# Altium schematic sheet RAM.SchDoc: SDRAM
size B; Engineer: M. Jones; Organization: Michael Jones; DocumentNumber: 7; Revision: RA.1; SheetNumber: 7; SheetTotal: 7
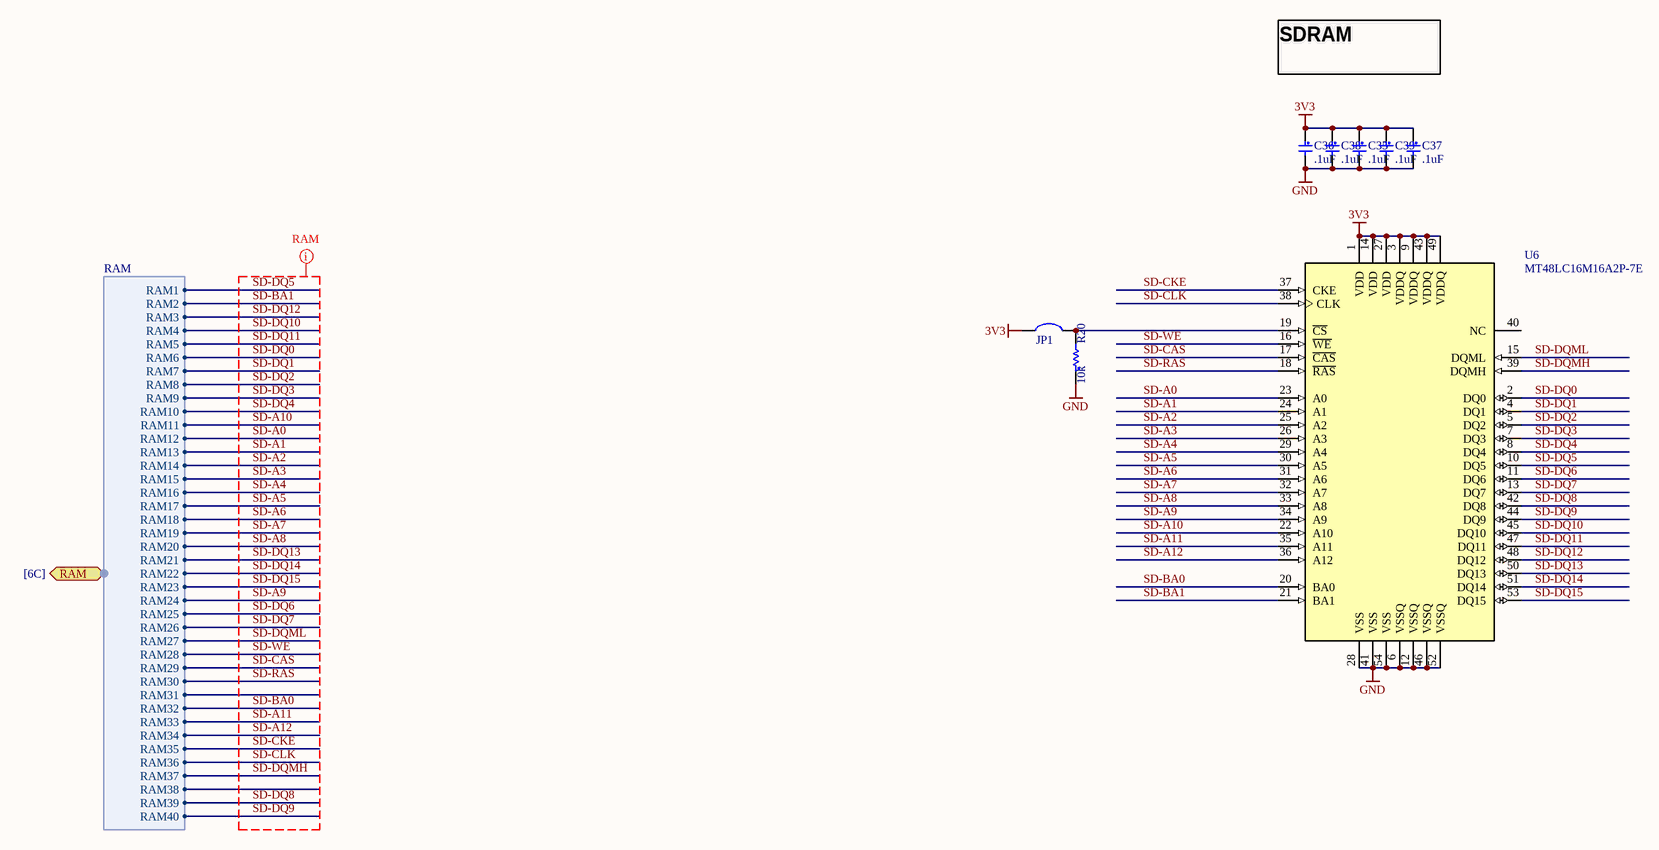
[diagram p0: RAM.SchDoc]

## Parts
C35  .1uF  [c0603]
C36  .1uF  [c0603]
C37  .1uF  [c0603]
C38  .1uF  [c0603]
C39  .1uF  [c0603]
JP1  Solder Jumper  [SOLDER_JUMPER]  (value not drawn)  (no BOM)
R20  10k  [R0603]
U6  MT48LC16M16A2P-7E  [TSOP2-54_L]

## Ports
RAM (harness RAM, see [6C])

## Harnesses
RAM: RAM1, RAM2, RAM3, RAM4, RAM5, RAM6, RAM7, RAM8, RAM9, RAM10, RAM11, RAM12, RAM13, RAM14, RAM15, RAM16, RAM17, RAM18, RAM19, RAM20, RAM21, RAM22, RAM23, RAM24, RAM25, RAM26, RAM27, RAM28, RAM29, RAM30, RAM31, RAM32, RAM33, RAM34, RAM35, RAM36, RAM37, RAM38, RAM39, RAM40

## Nets
3V3: C35.1 C36.1 C37.1 C38.1 C39.1 JP1.1 U6.1(VDD) U6.3(VDDQ) U6.9(VDDQ) U6.14(VDD) U6.27(VDD) U6.43(VDDQ) U6.49(VDDQ)
GND: C35.2 C36.2 C37.2 C38.2 C39.2 R20.1 U6.6(VSSQ) U6.12(VSSQ) U6.28(VSS) U6.41(VSS) U6.46(VSSQ) U6.52(VSSQ) U6.54(VSS)
SD-A0: U6.23(A0) ; port RAM.RAM12
SD-A1: U6.24(A1) ; port RAM.RAM13
SD-A2: U6.25(A2) ; port RAM.RAM14
SD-A3: U6.26(A3) ; port RAM.RAM15
SD-A4: U6.29(A4) ; port RAM.RAM16
SD-A5: U6.30(A5) ; port RAM.RAM17
SD-A6: U6.31(A6) ; port RAM.RAM18
SD-A7: U6.32(A7) ; port RAM.RAM19
SD-A8: U6.33(A8) ; port RAM.RAM20
SD-A9: U6.34(A9) ; port RAM.RAM24
SD-A10: U6.22(A10) ; port RAM.RAM11
SD-A11: U6.35(A11) ; port RAM.RAM33
SD-A12: U6.36(A12) ; port RAM.RAM34
SD-BA0: U6.20(BA0) ; port RAM.RAM32
SD-BA1: U6.21(BA1) ; port RAM.RAM2
SD-CAS: U6.17(~{CAS}) ; port RAM.RAM29
SD-CKE: U6.37(CKE) ; port RAM.RAM35
SD-CLK: U6.38(CLK) ; port RAM.RAM36
SD-DQ0: U6.2(DQ0) ; port RAM.RAM6
SD-DQ1: U6.4(DQ1) ; port RAM.RAM7
SD-DQ2: U6.5(DQ2) ; port RAM.RAM8
SD-DQ3: U6.7(DQ3) ; port RAM.RAM9
SD-DQ4: U6.8(DQ4) ; port RAM.RAM10
SD-DQ5: U6.10(DQ5) ; port RAM.RAM1
SD-DQ6: U6.11(DQ6) ; port RAM.RAM25
SD-DQ7: U6.13(DQ7) ; port RAM.RAM26
SD-DQ8: U6.42(DQ8) ; port RAM.RAM39
SD-DQ9: U6.44(DQ9) ; port RAM.RAM40
SD-DQ10: U6.45(DQ10) ; port RAM.RAM4
SD-DQ11: U6.47(DQ11) ; port RAM.RAM5
SD-DQ12: U6.48(DQ12) ; port RAM.RAM3
SD-DQ13: U6.50(DQ13) ; port RAM.RAM21
SD-DQ14: U6.51(DQ14) ; port RAM.RAM22
SD-DQ15: U6.53(DQ15) ; port RAM.RAM23
SD-DQMH: U6.39(DQMH) ; port RAM.RAM37
SD-DQML: U6.15(DQML) ; port RAM.RAM27
SD-RAS: U6.18(~{RAS}) ; port RAM.RAM30
SD-WE: U6.16(~{WE}) ; port RAM.RAM28
NetJP1_2: JP1.2 R20.2 U6.19(~{CS})

Not connected (* = marked no-connect by the designer): U6 40(NC)

## Layout directives
net class RAM: SD-A0, SD-A1, SD-A2, SD-A3, SD-A4, SD-A5, SD-A6, SD-A7, SD-A8, SD-A9, SD-A10, SD-A11, SD-A12, SD-BA0, SD-BA1, SD-CAS, SD-CKE, SD-CLK, SD-DQ0, SD-DQ1, SD-DQ2, SD-DQ3, SD-DQ4, SD-DQ5, SD-DQ6, SD-DQ7, SD-DQ8, SD-DQ9, SD-DQ10, SD-DQ11, SD-DQ12, SD-DQ13, SD-DQ14, SD-DQ15, SD-DQMH, SD-DQML, SD-RAS, SD-WE

## Notes on the sheet
- SDRAM
- Title
- Revision:
- Sheet
- of
- Date:
- Engineer:

## Library data of the parts
C35-C39 = C0603 - CL10F104ZA8NNNC: CAP CER 0.1UF 25V Y5V 0603; Manufacturer: Samsung Electro-Mechanics America, Inc; Capacitance: 0.1µF; Tolerance: -20%, +80%; Temperature Coefficient: Y5V (F); Accept Alternative: Yes; Supplier 1: Digi-Key; Manufacturer Part Number: CL10F104ZA8NNNC; RoHS: RoHS Compliant; Category: Capacitors; Stock 1: 400907; Pricing 1: 1=0.1, 10=0.017, 25=0.012, 50=0.009, 100=0.0076, 250=0.00624, 500=0.00536, 1000=0.00417 (USD); Package / Case: 0603 (1608 Metric); Packaging: Cut Tape (CT); ComponentLink1URL: http://www.samsungsem.com/servlet/FileDownload?type=spec&file=CL10F104ZA8NNNC.pdf; ComponentLink1Description: http://www.samsungsem.com/servlet/FileDownload?type=spec&file=CL10F104ZA8NNNC.pdf; Supplier Part Number 1: 1276-1011-1-ND; Value: .1uF; Voltage - Rated: 25V; Mounting Type: Surface Mount, MLCC; Operating Temperature: -30°C ~ 85°C; Applications: General Purpose; Ratings: -; Size / Dimension: 0.063" L x 0.031" W (1.60mm x 0.80mm); Height - Seated (Max): -; Thickness (Max): 0.035" (0.90mm); Lead Spacing: -; Features: -; Lead Style: -
JP1 = Solder Jumper: Solder/Configuration Jumper; Manufacturer: n/a; Manufacturer Part Number: n/a; Source: n/a; Source Part Number: n/a; ROHS Certificate: n/a
R20 = R0603 - CRCW060310K0FKEA: 10k Thick Film Resistors - SMD 1/10watt 10Kohms 1%; Manufacturer: Vishay Dale; Power (Watts): 0.1W, 1/10W; Temperature Coefficient: ±100ppm/°C; Manufacturer Part Number: CRCW060310K0FKEA; Value: 10k; Supplier 1: Digi-Key; RoHS: RoHS Compliant; Category: Resistors; Stock 1: 997856; Pricing 1: 10=0.081, 50=0.0436, 200=0.0251, 1000=0.01711 (USD); Resistance (Ohms): 10K; Composition: Thick Film; Features: -; Tolerance: ±1%; Size / Dimension: 0.061" L x 0.033" W (1.55mm x 0.85mm); Height: 0.020" (0.50mm); Packaging: Cut Tape (CT); Package / Case: 0603 (1608 Metric); ComponentLink1URL: http://www.vishay.com/doc?20035; ComponentLink1Description: http://www.vishay.com/doc?20035; Supplier Part Number 1: 541-10.0KHCT-ND; Number of Terminations: 2
U6 = SDRAM - MT48LC16M16A2P-7E: 256Mb Synchronous High-Speed CMOS DRAM, 16Mb x 16Bit x 4 Banks, 54-Pin TSOP Pb-free, Commercial; Manufacturer: MICRON; Manufacturer Part Number: MT48LC16M16A2P-7E IT:G; Supplier 1: Avnet; RoHS: YES; Stock 1: 662; Pricing 1: 1=6.65, 100=4.68, 1000=4.22 (USD); ComponentLink1URL: http://avnetexpress.avnet.com/store/em/EMController?langId=-1&storeId=500201&catalogId=500201&term=mt48lc16m16a2p&x=-860&y=-339&searchType=&advAction=&N=0&Ne=100000&action=products; ComponentLink1Description: http://avnetexpress.avnet.com/store/em/EMController?langId=-1&storeId=500201&catalogId=500201&term=mt48lc16m16a2p&x=-860&y=-339&searchType=&advAction=&N=0&Ne=100000&action=products; Supplier Part Number 1: MT48LC16M16A2P-7E IT:G; Value: MT48LC16M16A2P-7E